# EAGLE schematic digital in (EAGLE 6.0)
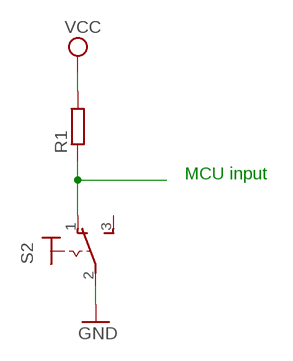
[diagram p0: schematic, sheet 1]

## Parts
R1  R-EU_0204/7  [0204/7]
S2  M9040P  [M9040P]

## Nets
GND: S2.2(P)
N$1: R1.1 S2.1(O)
VCC: R1.2
Unconnected: S2.3(S)

## Notes on the sheet
- MCU input

## Library data of the parts
R1 = rcl:R-EU_: RESISTOR, European symbol
S2 = switch:M9040P: TOGGLE SWITCH Marquardt